# EAGLE schematic 7segement4digits1badidea-huge-digits-mk-1.0 (EAGLE 7.5.0)
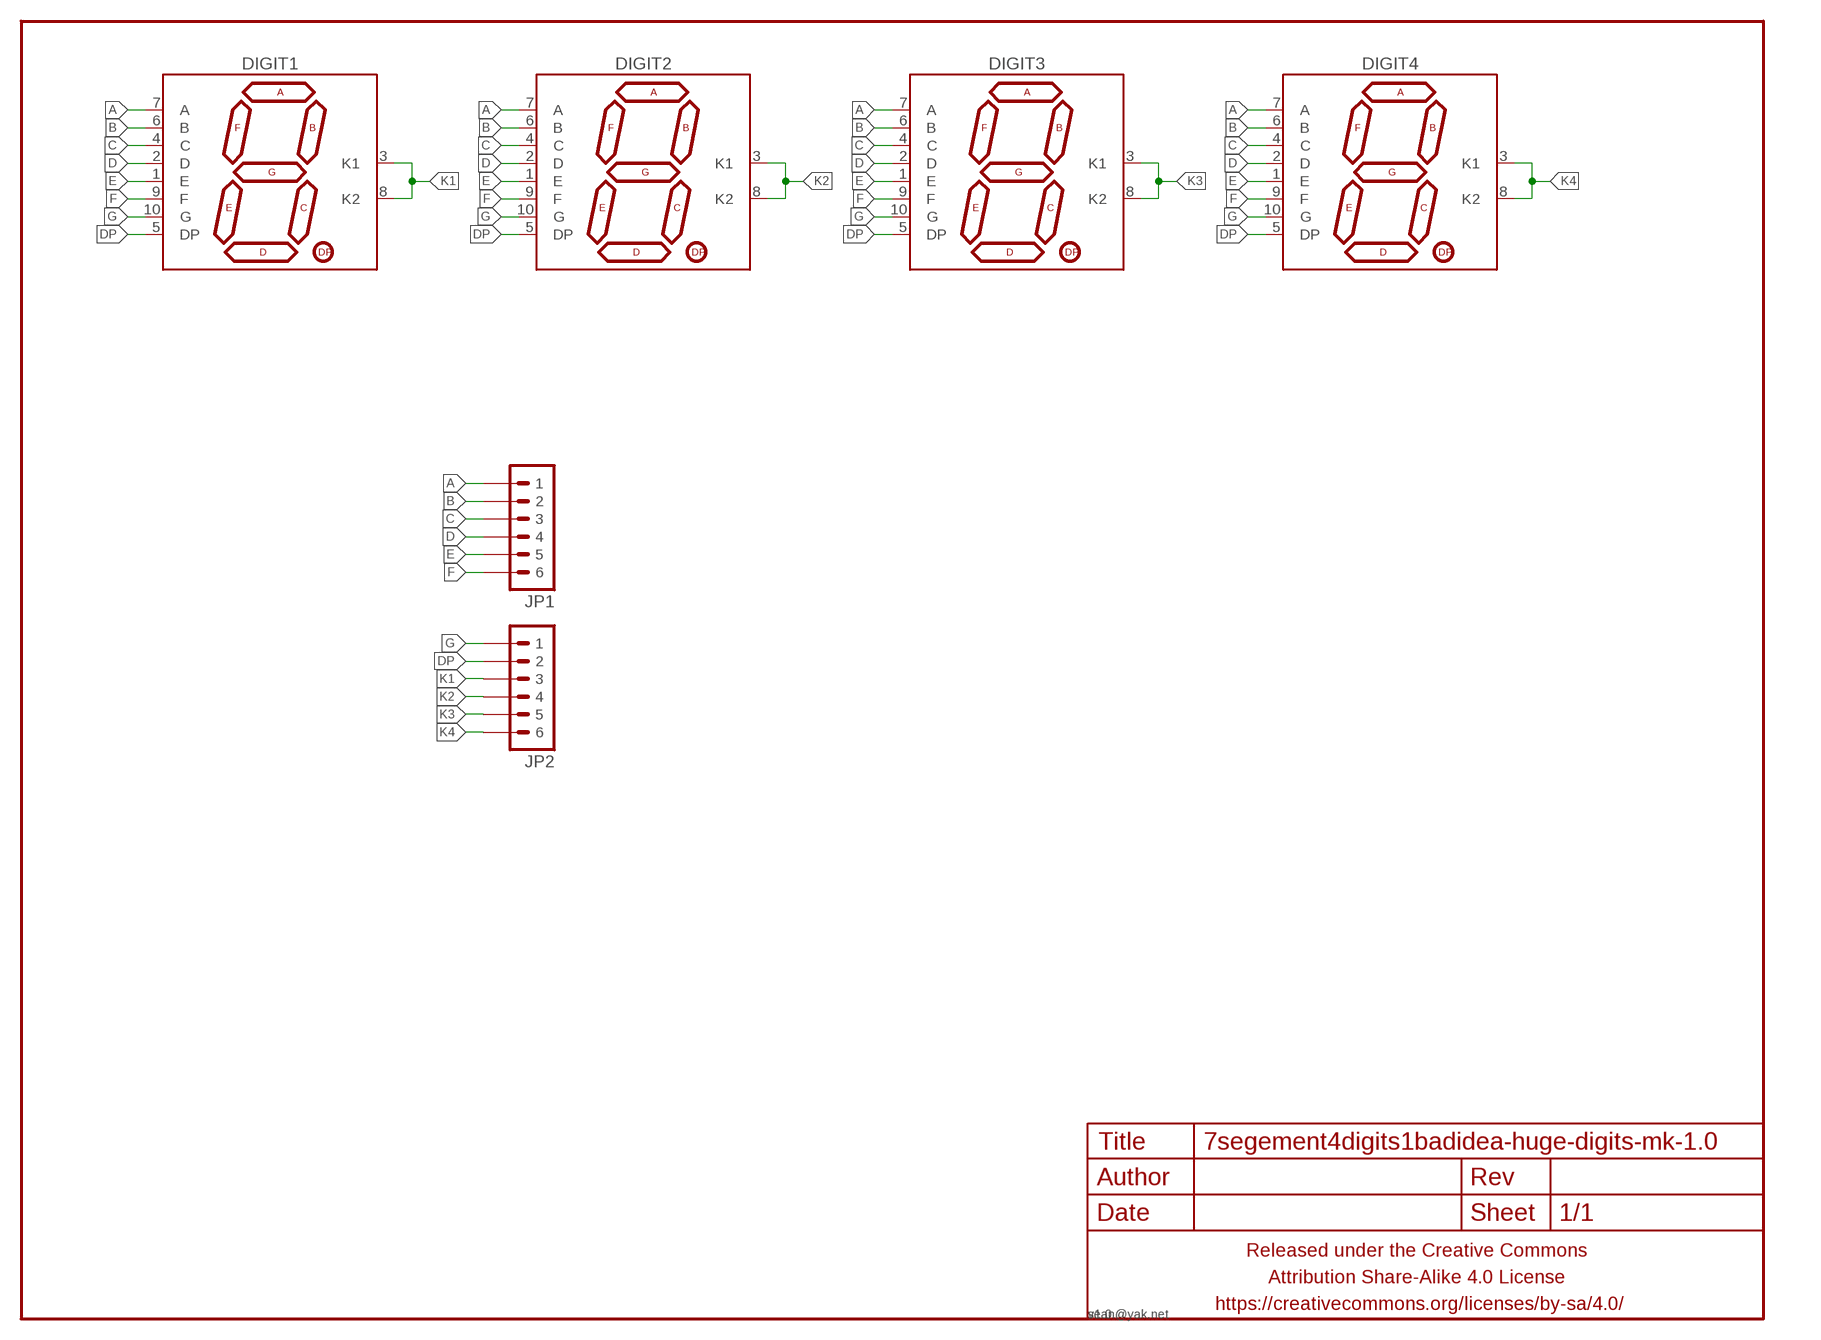
[diagram p0: schematic, sheet 1]

## Parts
DIGIT1  7SEG_1DIGPTH-25.4MM  [7SEG_1DIG_25.4MM]
DIGIT2  7SEG_1DIGPTH-25.4MM  [7SEG_1DIG_25.4MM]
DIGIT3  7SEG_1DIGPTH-25.4MM  [7SEG_1DIG_25.4MM]
DIGIT4  7SEG_1DIGPTH-25.4MM  [7SEG_1DIG_25.4MM]
FRAME1  FRAME-LETTERNO_PACKAGE  [DUMMY]
JP1  M06PTH_CENTERED  [1X06_CENTERED]
JP2  M06PTH_CENTERED  [1X06_CENTERED]

## Nets
A: DIGIT1.7(A) DIGIT2.7(A) DIGIT3.7(A) DIGIT4.7(A) JP1.1
B: DIGIT1.6(B) DIGIT2.6(B) DIGIT3.6(B) DIGIT4.6(B) JP1.2
C: DIGIT1.4(C) DIGIT2.4(C) DIGIT3.4(C) DIGIT4.4(C) JP1.3
D: DIGIT1.2(D) DIGIT2.2(D) DIGIT3.2(D) DIGIT4.2(D) JP1.4
DP: DIGIT1.5(DP) DIGIT2.5(DP) DIGIT3.5(DP) DIGIT4.5(DP) JP2.2
E: DIGIT1.1(E) DIGIT2.1(E) DIGIT3.1(E) DIGIT4.1(E) JP1.5
F: DIGIT1.9(F) DIGIT2.9(F) DIGIT3.9(F) DIGIT4.9(F) JP1.6
G: DIGIT1.10(G) DIGIT2.10(G) DIGIT3.10(G) DIGIT4.10(G) JP2.1
K1: DIGIT1.3(K1) DIGIT1.8(K2) JP2.3
K2: DIGIT2.3(K1) DIGIT2.8(K2) JP2.4
K3: DIGIT3.3(K1) DIGIT3.8(K2) JP2.5
K4: DIGIT4.3(K1) DIGIT4.8(K2) JP2.6

## Library data of the parts
DIGIT1-DIGIT4 = A_butts:7SEG_1DIG
FRAME1 = A_butts:FRAME-LETTER: Schematic Frame Standard 8.5x11 US Letter frame; DESIGNER: sean@yak.net; VERSION: v1.0
JP1 JP2 = A_butts:M06: Header 6 Standard 6-pin 0.1" header. Use with straight break away headers (SKU : PRT-00116), right angle break away headers (PRT-00553), swiss pins (PRT-00743), machine pins (PRT-00117), and female headers (PRT-00115). Molex polarized connector foot print use with SKU : PRT-08094 with associated crimp pins and housings. NOTES ON THE VARIANTS LOCK and LOCK_LONGPADS... This footprint was designed to help hold the alignment of a through-hole component (i.e. 6-pin header) while soldering it into place. You may notice that each hole has been shifted either up or down by 0.005 of an inch from it's more standard position (which is a perfectly straight line). This slight alteration caused the pins (the squares in the middle) to touch the edges of the holes. Because they are alternating, it causes a "brace" to hold the component in place. 0.005 has proven to be the perfect amount of "off-center" position when using our standard breakaway headers. Although looks a little odd when you look at the bare footprint, once you have a header in there, the alteration is very hard to notice. Also,if you push a header all the way into place, it is covered up entirely on the bottom side. This idea of altering the position of holes to aid alignment will be further integrated into the Sparkfun Library for other footprints. It can help hold any component with 3 or more connection pins.